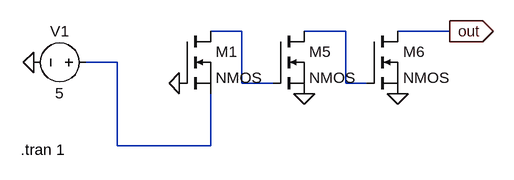
[diagram p0: schematic Draft26.asc]
Draft26.asc, the LTspice schematic file:
Version 4
SHEET 1 880 680
WIRE 400 256 352 256
WIRE 560 256 496 256
WIRE 720 256 640 256
WIRE 208 304 160 304
WIRE 400 336 400 256
WIRE 448 336 400 336
WIRE 560 336 560 256
WIRE 592 336 560 336
WIRE 208 432 208 304
WIRE 352 432 352 352
WIRE 352 432 208 432
FLAG 80 304 0
FLAG 720 256 out
IOPIN 720 256 Out
FLAG 640 352 0
FLAG 496 352 0
FLAG 304 336 0
SYMBOL nmos 304 256 R0
SYMATTR InstName M1
SYMBOL nmos 448 256 R0
SYMATTR InstName M5
SYMBOL nmos 592 256 R0
SYMATTR InstName M6
SYMBOL voltage 176 304 R90
WINDOW 0 -32 56 VBottom 2
WINDOW 3 32 56 VTop 2
WINDOW 123 0 0 Left 0
WINDOW 39 0 0 Left 0
SYMATTR InstName V1
SYMATTR Value 5
TEXT 60 438 Left 2 !.tran 1

The netlist it stands for:
* Draft26.asc
M1 N001 0 N003 N003 NMOS
M5 N002 N001 0 0 NMOS
M6 out N002 0 0 NMOS
V1 N003 0 5
.model NMOS NMOS
.model PMOS PMOS
.lib standard.mos
.tran 1
.backanno
.end